# Altium schematic sheet CYUSB_IO.SchDoc
size A3
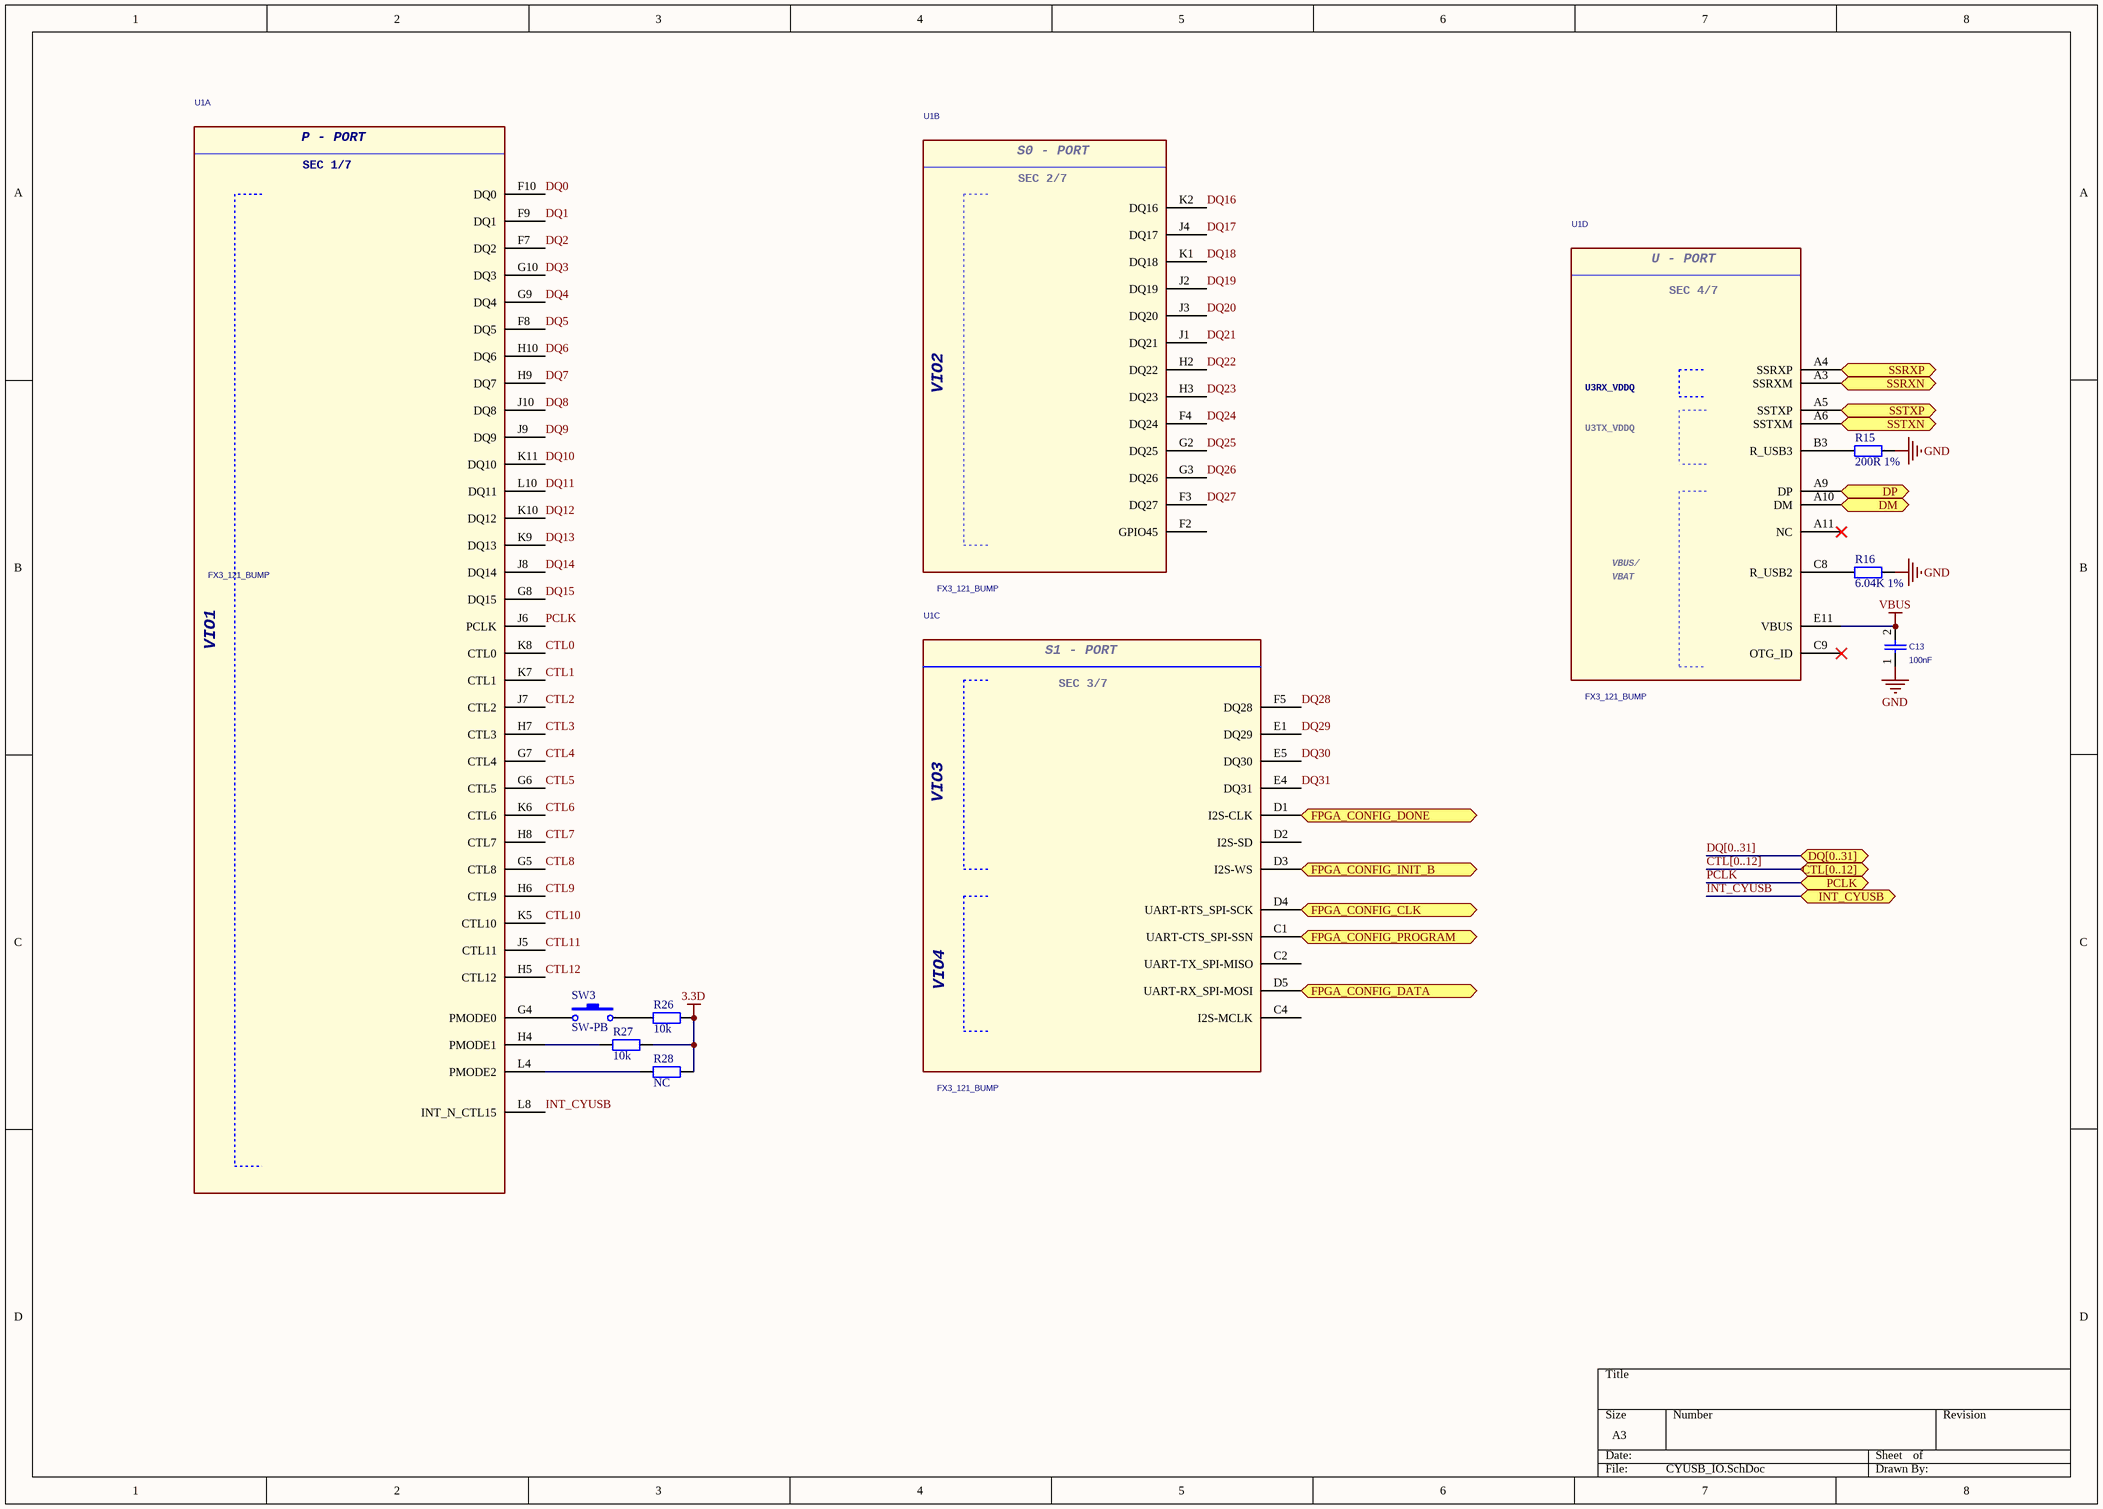
[diagram p0: CYUSB_IO.SchDoc]

## Parts
C13  100nF  [0201]
R15  200R 1%  [0201]
R16  6.04K 1%  [0201]
R26  10k  [0201]
R27  10k  [0201]
R28  NC  [0201]
SW3  SW-PB  [SW-SIDE]
U1  FX3_121_BUMP  [FX3_121_BUMP]  (parts A,B,C,D of 8)

## Ports
CTL[0..12], DM, DP, DQ[0..31], FPGA_CONFIG_CLK, FPGA_CONFIG_DATA, FPGA_CONFIG_DONE, FPGA_CONFIG_INIT_B, FPGA_CONFIG_PROGRAM, INT_CYUSB, PCLK, SSRXN, SSRXP, SSTXN, SSTXP

## Nets
3.3D: R26.1 R27.1 R28.1
GND: C13.1 R15.2 R16.2
VBUS: C13.2 U1.E11(VBUS)
CTL0: U1.K8(CTL0)
CTL1: U1.K7(CTL1)
CTL2: U1.J7(CTL2)
CTL3: U1.H7(CTL3)
CTL4: U1.G7(CTL4)
CTL5: U1.G6(CTL5)
CTL6: U1.K6(CTL6)
CTL7: U1.H8(CTL7)
CTL8: U1.G5(CTL8)
CTL9: U1.H6(CTL9)
CTL10: U1.K5(CTL10)
CTL11: U1.J5(CTL11)
CTL12: U1.H5(CTL12)
DM: U1.A10(DM) ; port DM
DP: U1.A9(DP) ; port DP
DQ0: U1.F10(DQ0)
DQ1: U1.F9(DQ1)
DQ2: U1.F7(DQ2)
DQ3: U1.G10(DQ3)
DQ4: U1.G9(DQ4)
DQ5: U1.F8(DQ5)
DQ6: U1.H10(DQ6)
DQ7: U1.H9(DQ7)
DQ8: U1.J10(DQ8)
DQ9: U1.J9(DQ9)
DQ10: U1.K11(DQ10)
DQ11: U1.L10(DQ11)
DQ12: U1.K10(DQ12)
DQ13: U1.K9(DQ13)
DQ14: U1.J8(DQ14)
DQ15: U1.G8(DQ15)
DQ16: U1.K2(DQ16)
DQ17: U1.J4(DQ17)
DQ18: U1.K1(DQ18)
DQ19: U1.J2(DQ19)
DQ20: U1.J3(DQ20)
DQ21: U1.J1(DQ21)
DQ22: U1.H2(DQ22)
DQ23: U1.H3(DQ23)
DQ24: U1.F4(DQ24)
DQ25: U1.G2(DQ25)
DQ26: U1.G3(DQ26)
DQ27: U1.F3(DQ27)
DQ28: U1.F5(DQ28)
DQ29: U1.E1(DQ29)
DQ30: U1.E5(DQ30)
DQ31: U1.E4(DQ31)
FPGA_CONFIG_CLK: U1.D4(UART-RTS_SPI-SCK) ; port FPGA_CONFIG_CLK
FPGA_CONFIG_DATA: U1.D5(UART-RX_SPI-MOSI) ; port FPGA_CONFIG_DATA
FPGA_CONFIG_DONE: U1.D1(I2S-CLK) ; port FPGA_CONFIG_DONE
FPGA_CONFIG_INIT_B: U1.D3(I2S-WS) ; port FPGA_CONFIG_INIT_B
FPGA_CONFIG_PROGRAM: U1.C1(UART-CTS_SPI-SSN) ; port FPGA_CONFIG_PROGRAM
INT_CYUSB: U1.L8(INT_N_CTL15) ; port INT_CYUSB
PCLK: U1.J6(PCLK) ; port PCLK
SSRXN: U1.A3(SSRXM) ; port SSRXN
SSRXP: U1.A4(SSRXP) ; port SSRXP
SSTXN: U1.A6(SSTXM) ; port SSTXN
SSTXP: U1.A5(SSTXP) ; port SSTXP
NetR15_1: R15.1 U1.B3(R_USB3)
NetR16_1: R16.1 U1.C8(R_USB2)
NetR26_2: R26.2 SW3.2
NetR27_2: R27.2 U1.H4(PMODE1)
NetR28_2: R28.2 U1.L4(PMODE2)
NetSW3_1: SW3.1 U1.G4(PMODE0)

Not connected (* = marked no-connect by the designer): U1 A11(NC)* C2(UART-TX_SPI-MISO) C4(I2S-MCLK) C9(OTG_ID)* D2(I2S-SD) F2(GPIO45)

## Buses and harness runs
bus CTL[0..12] = port CTL[0..12]
bus DQ[0..31] = port DQ[0..31]

## Notes on the sheet
- (in symbol FX3_121_BUMP_10, part A) P - PORT; SEC 1/7; VIO1
- (in symbol FX3_121_BUMP_10, part B) S0 - PORT; SEC 2/7
- (in symbol FX3_121_BUMP_10, part C) S1 - PORT; SEC 3/7
- (in symbol FX3_121_BUMP_10, part D) U - PORT; SEC 4/7; U3RX_VDDQ; U3TX_VDDQ; VBUS/

## Library data of the parts
C13 = CAP/0402: 1st Part Field: 0402
R15 R16 R26-R28 = Res2: Resistor; Published: 8-Jun-2000; LatestRevisionDate: 17-Jul-2002; LatestRevisionNote: Re-released for DXP Platform.; PackageReference: AXIAL-0.4; Publisher: Altium Limited; PackageDescription: Axial Device, Thru-Hole; 2 Leads; 0.4 in Pin Spacing
SW3 = SW-PB: Switch; Published: 24-Mar-1999; LatestRevisionDate: 17-Jul-2002; LatestRevisionNote: Re-released for DXP Platform.; PackageReference: SPST-2; Publisher: Altium Limited; PackageDescription: Switch; 2 Leads
U1 = FX3_121_BUMP_10: FX3; Manufacturer: Cypress